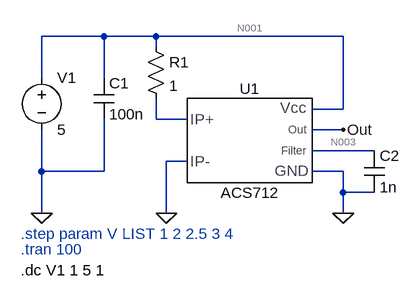
[diagram p0: schematic ACS712_Test.asc]
ACS712_Test.asc, the LTspice schematic file:
Version 4
SHEET 1 884 680
WIRE 48 32 -48 32
WIRE 128 32 48 32
WIRE 416 32 128 32
WIRE 128 48 128 32
WIRE -48 96 -48 32
WIRE 48 96 48 32
WIRE 416 144 416 32
WIRE 416 144 368 144
WIRE 128 160 128 128
WIRE 176 160 128 160
WIRE 416 176 368 176
WIRE 464 208 368 208
WIRE 176 224 144 224
WIRE -48 240 -48 176
WIRE 48 240 48 160
WIRE 48 240 -48 240
WIRE 416 240 368 240
WIRE 416 272 416 240
WIRE 464 272 416 272
WIRE -48 304 -48 240
WIRE 144 304 144 224
WIRE 416 304 416 272
FLAG -48 304 0
FLAG 144 304 0
FLAG 416 304 0
FLAG 416 176 Out
SYMBOL ACS712 272 192 R0
SYMATTR InstName U1
SYMBOL voltage -48 80 R0
WINDOW 123 0 0 Left 0
WINDOW 39 0 0 Left 0
SYMATTR InstName V1
SYMATTR Value 5
SYMBOL res 112 32 R0
SYMATTR InstName R1
SYMATTR Value 1
SYMBOL cap 32 96 R0
SYMATTR InstName C1
SYMATTR Value 100n
SYMBOL cap 448 208 R0
SYMATTR InstName C2
SYMATTR Value 1n
TEXT -80 336 Left 2 ;.step param V LIST 1 2 2.5 3 4
TEXT -80 360 Left 2 ;.tran 100
TEXT -80 392 Left 2 !.dc V1 1 5 1

The netlist it stands for:
* ACS712_Test.asc
XU1 N002 0 N003 Out N001 0 ACS712  ; pins I+ I- Filter Out V+ V-
V1 N001 0 5
R1 N001 N002 1
C1 N001 0 100n
C2 N003 0 1n
* .step param V LIST 1 2 2.5 3 4
* .tran 100
.dc V1 1 5 1
.lib ACS712.lib
.backanno
.end

* Results of the author's LTspice run, read from the files saved beside the schematic
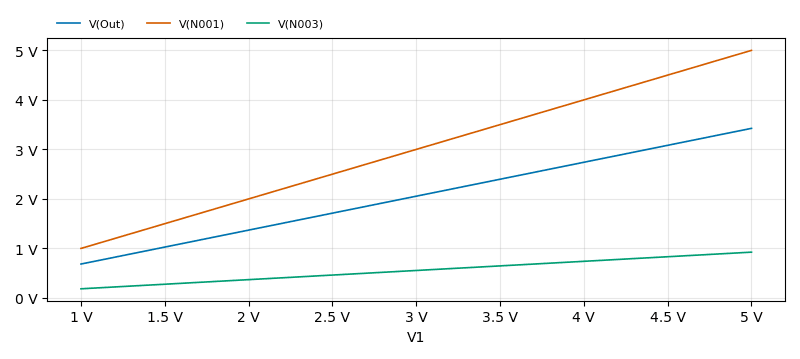
[diagram p1: DC transfer characteristic of ACS712_Test.asc, plotted from the saved traces]
* DC transfer characteristic, 1 run:
*   V(Out): 685 mV at V1=1 V, 3.425 V at V1=5 V, min 685 mV, max 3.425 V
*   V(N001): 1 V at V1=1 V, 5 V at V1=5 V, min 1 V, max 5 V
*   V(N003): 185 mV at V1=1 V, 925 mV at V1=5 V, min 185 mV, max 925 mV